# Altium project PIC_with_USB_2_0.PrjPcb
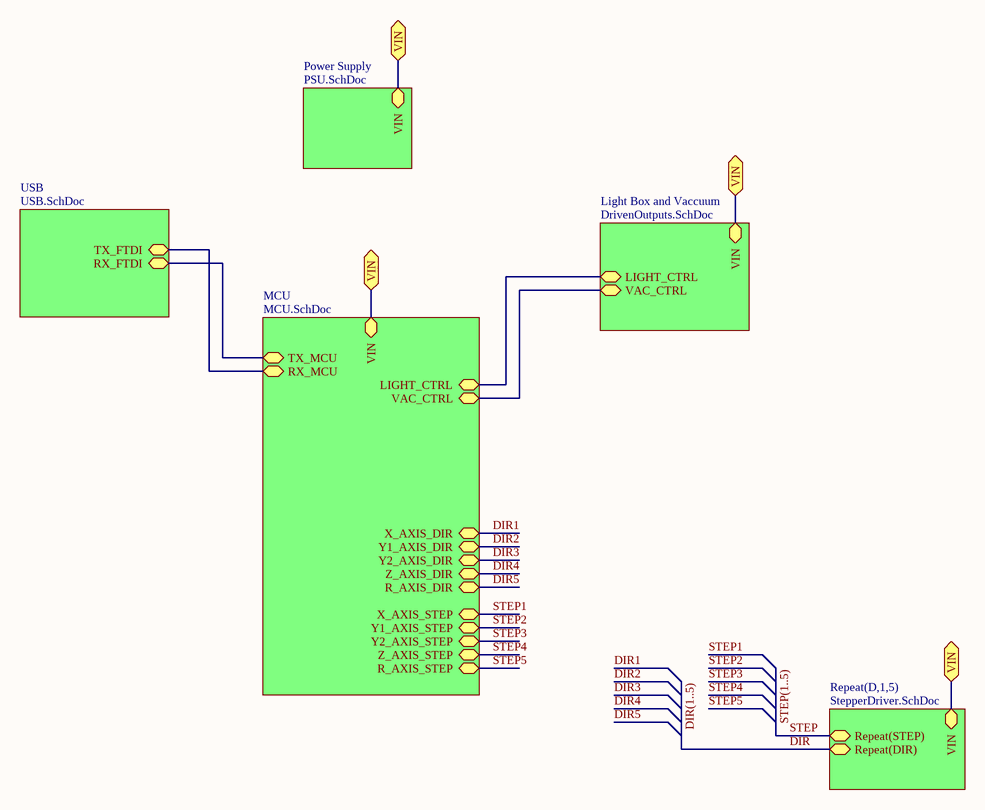
[diagram p0: Top.SchDoc]
6 sheets, 71 parts. Net scope: hierarchical (ports join the sheet entries above them; power ports are global).
Board file: picwithusb_REV_2_0.PcbDoc
Sheets:
  Top.SchDoc
    MCU = MCU.SchDoc
    USB = USB.SchDoc
    Light Box and Vaccuum = DrivenOutputs.SchDoc
    D1 = StepperDriver.SchDoc
    D2 = StepperDriver.SchDoc
    D3 = StepperDriver.SchDoc
    D4 = StepperDriver.SchDoc
    D5 = StepperDriver.SchDoc
    Power Supply = PSU.SchDoc

## Sheet Top.SchDoc
size A

### Sub-sheets
Light Box and Vaccuum = DrivenOutputs.SchDoc: LIGHT_CTRL, VAC_CTRL, VIN
MCU = MCU.SchDoc: VAC_CTRL, TX_MCU, RX_MCU, X_AXIS_STEP, Y2_AXIS_STEP, X_AXIS_DIR, Y2_AXIS_DIR, Z_AXIS_DIR, Y1_AXIS_DIR, Y1_AXIS_STEP, LIGHT_CTRL, VIN, R_AXIS_DIR, Z_AXIS_STEP, R_AXIS_STEP
Power Supply = PSU.SchDoc: VIN
Repeat(D,1,5) = StepperDriver.SchDoc: Repeat(STEP), Repeat(DIR), VIN
USB = USB.SchDoc: TX_FTDI, RX_FTDI

### Ports
VIN

### Nets
DIR: sheet Repeat(D,1,5)/Repeat(DIR)
RC6: sheet MCU/TX_MCU, sheet USB/RX_FTDI
RC7: sheet MCU/RX_MCU, sheet USB/TX_FTDI
RD2: sheet MCU/VAC_CTRL, sheet Light Box and Vaccuum/VAC_CTRL
RD3: sheet MCU/LIGHT_CTRL, sheet Light Box and Vaccuum/LIGHT_CTRL
STEP: sheet Repeat(D,1,5)/Repeat(STEP)
VIN: port VIN, sheet MCU/VIN, sheet Light Box and Vaccuum/VIN, sheet Repeat(D,1,5)/VIN, sheet Power Supply/VIN

### Buses and harness runs
bus DIR(1..5)
bus STEP(1..5)

## Sheet MCU.SchDoc
size A
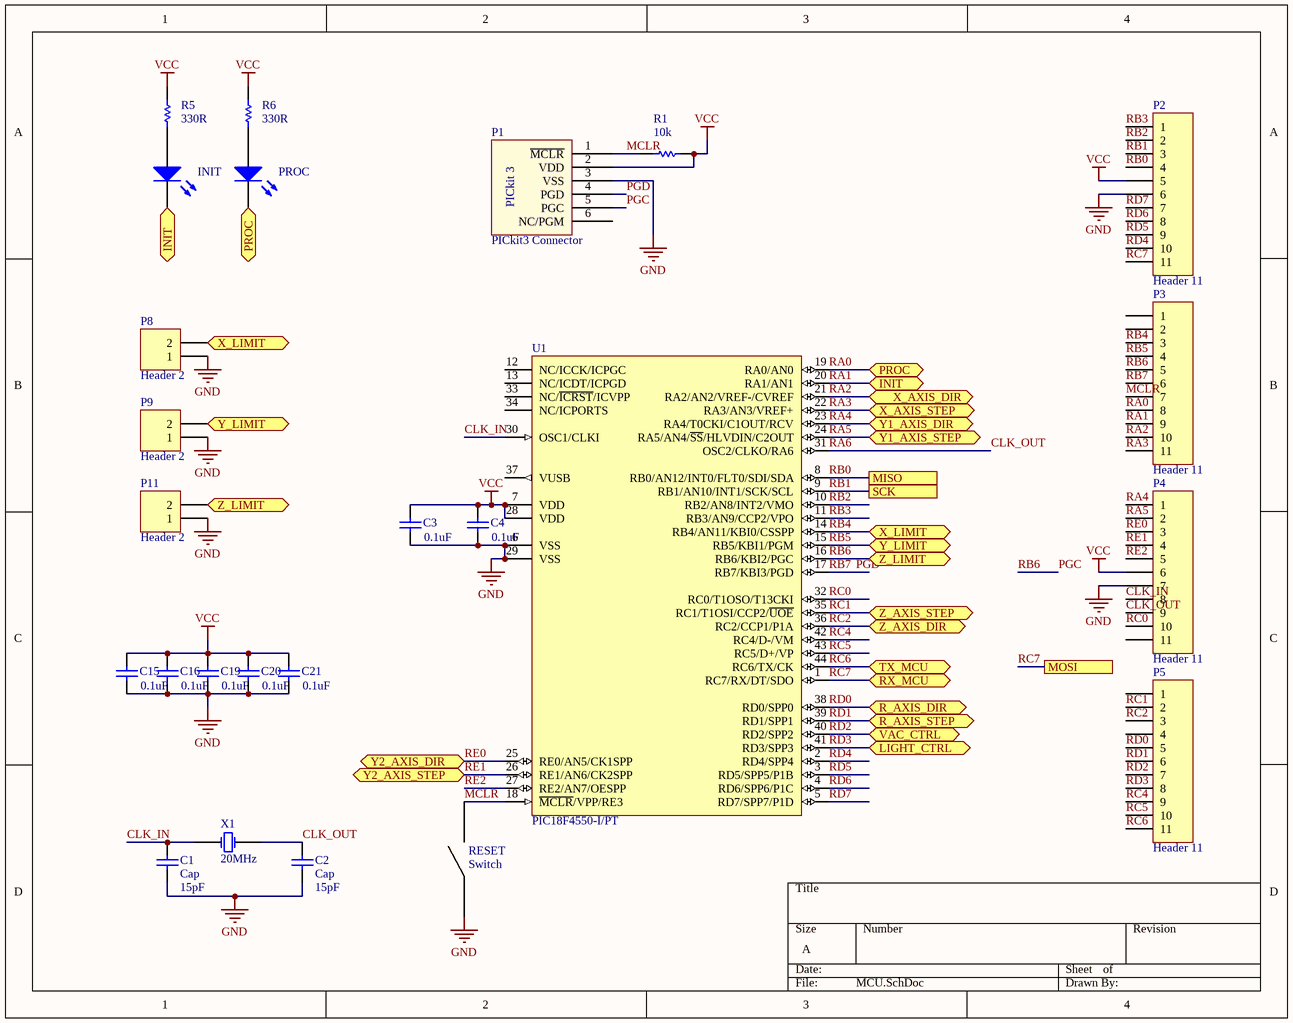
[diagram p1: MCU.SchDoc]

### Parts
C1  Cap  value 15pF  [0603]
C2  Cap  value 15pF  [0603]
C3  value 0.1uF  [0805]  (hidden comment: Cap)
C4  value 0.1uF  [0805]  (hidden comment: Cap)
C15  value 0.1uF  [0805]  (hidden comment: Cap)
C16  value 0.1uF  [0805]  (hidden comment: Cap)
C19  value 0.1uF  [0805]  (hidden comment: Cap)
C20  value 0.1uF  [0805]  (hidden comment: Cap)
C21  value 0.1uF  [0805]  (hidden comment: Cap)
INIT  LED1  [0805]  (value not drawn)
P1  PICkit3 Connector  [Right Angle PICkit Connector]
P2  Header 11  [HDR1X11]
P3  Header 11  [HDR1X11]
P4  Header 11  [HDR1X11]
P5  Header 11  [HDR1X11]
P8  Header 2  [HDR1X2]
P9  Header 2  [HDR1X2]
P11  Header 2  [HDR1X2]
PROC  LED2  [0805]  (value not drawn)
R1  value 10k  [0805]  (hidden comment: Res1)
R5  value 330R  [6-0805_N]  (hidden comment: Res1)
R6  value 330R  [6-0805_N]  (hidden comment: Res1)
RESET  Switch  [TACT_SWITCH]
U1  PIC18F4550-I/PT  [TQFP-PT44_N]
X1  Frequency: 20MHz  [HC49-US]  (hidden comment: Crystal)

### Ports
INIT, LIGHT_CTRL, MISO, MOSI, PROC, R_AXIS_DIR, R_AXIS_STEP, RX_MCU, SCK, TX_MCU, VAC_CTRL, X_AXIS_DIR, X_AXIS_STEP, X_LIMIT, Y1_AXIS_DIR, Y1_AXIS_STEP, Y2_AXIS_DIR, Y2_AXIS_STEP, Y_LIMIT, Z_AXIS_DIR, Z_AXIS_STEP, Z_LIMIT

### Nets
1: RESET.2
4: RESET.4
GND: C1.1 C2.1 C3.1 C4.1 C15.1 C16.1 C19.1 C20.1 C21.1 P1.3(VSS) P2.6 P4.7 P8.1 P9.1 P11.1 RESET.1 U1.6(VSS) U1.29(VSS)
VCC: C3.2 C4.2 C15.2 C16.2 C19.2 C20.2 C21.2 P1.2(VDD) P2.5 P4.6 R1.2 R5.2 R6.2 U1.7(VDD) U1.28(VDD)
CLK_IN: C1.2 P4.8 U1.30(OSC1/CLKI) X1.1(OSC1)
CLK_OUT: C2.2 P4.9 U1.31(OSC2/CLKO/RA6) X1.2(OSC2)  [also labelled RA6]
MCLR: P1.1(~{MCLR}) P3.7 R1.1 RESET.3 U1.18(~{MCLR}/VPP/RE3)
PGC: P1.5(PGC) P3.5 P11.2 U1.16(RB6/KBI2/PGC) ; port Z_LIMIT  [also labelled RB6]
PGD: P1.4(PGD) P3.6 U1.17(RB7/KBI3/PGD)  [also labelled RB7]
RA0: P3.8 PROC.2(K) U1.19(RA0/AN0) ; port PROC
RA1: INIT.2(K) P3.9 U1.20(RA1/AN1) ; port INIT
RA2: P3.10 U1.21(RA2/AN2/VREF-/CVREF) ; port X_AXIS_DIR  [project net DIR1]
RA3: P3.11 U1.22(RA3/AN3/VREF+) ; port X_AXIS_STEP
RA4: P4.1 U1.23(RA4/T0CKI/C1OUT/RCV) ; port Y1_AXIS_DIR  [project net DIR2]
RA5: P4.2 U1.24(RA5/AN4/~{SS}/HLVDIN/C2OUT) ; port Y1_AXIS_STEP
RB0: P2.4 U1.8(RB0/AN12/INT0/FLT0/SDI/SDA) ; port MISO
RB1: P2.3 U1.9(RB1/AN10/INT1/SCK/SCL) ; port SCK
RB2: P2.2 U1.10(RB2/AN8/INT2/VMO)
RB3: P2.1 U1.11(RB3/AN9/CCP2/VPO)
RB4: P3.3 P8.2 U1.14(RB4/AN11/KBI0/CSSPP) ; port X_LIMIT
RB5: P3.4 P9.2 U1.15(RB5/KBI1/PGM) ; port Y_LIMIT
RC0: P4.10 U1.32(RC0/T1OSO/T13CKI)
RC1: P5.2 U1.35(RC1/T1OSI/CCP2/~{UOE}) ; port Z_AXIS_STEP
RC2: P5.3 U1.36(RC2/CCP1/P1A) ; port Z_AXIS_DIR  [project net DIR4]
RC4: P5.9 U1.42(RC4/D-/VM)
RC5: P5.10 U1.43(RC5/D+/VP)
RC6: P5.11 U1.44(RC6/TX/CK) ; port TX_MCU
RC7: P2.11 U1.1(RC7/RX/DT/SDO) ; port MOSI, port RX_MCU
RD0: P5.5 U1.38(RD0/SPP0) ; port R_AXIS_DIR  [project net DIR5]
RD1: P5.6 U1.39(RD1/SPP1) ; port R_AXIS_STEP
RD2: P5.7 U1.40(RD2/SPP2) ; port VAC_CTRL
RD3: P5.8 U1.41(RD3/SPP3) ; port LIGHT_CTRL
RD4: P2.10 U1.2(RD4/SPP4)
RD5: P2.9 U1.3(RD5/SPP5/P1B)
RD6: P2.8 U1.4(RD6/SPP6/P1C)
RD7: P2.7 U1.5(RD7/SPP7/P1D)
RE0: P4.3 U1.25(RE0/AN5/CK1SPP) ; port Y2_AXIS_DIR  [project net DIR3]
RE1: P4.4 U1.26(RE1/AN6/CK2SPP) ; port Y2_AXIS_STEP
RE2: P4.5 U1.27(RE2/AN7/OESPP)
NetINIT_1: INIT.1(A) R5.1
NetPROC_1: PROC.1(A) R6.1

Not connected (* = marked no-connect by the designer): P1 6(NC/PGM); P3 1 2; P4 11; P5 1 4; U1 12(NC/ICCK/ICPGC) 13(NC/ICDT/ICPGD) 33(NC/~{ICRST}/ICVPP) 34(NC/ICPORTS) 37(VUSB)

### Notes on the sheet
- (in symbol PICkit 3 Connector) PICkit 3

### Library data of the parts
C1-C4 C15 C16 C19-C21 = Cap: Capacitor; Published: 8-Jun-2000; LatestRevisionDate: 17-Jul-2002; LatestRevisionNote: Re-released for DXP Platform.; PackageReference: RAD-0.3; Publisher: Altium Limited; PackageDescription: Radial Cap, Thru-Hole; 2 Leads; 0.3 in Pin Spacing
INIT PROC = LED0: Typical INFRARED GaAs LED; Published: 8-Jun-2000; LatestRevisionDate: 08-Jul-2005; LatestRevisionNote: Mech Layer 1 removed.; PackageReference: LED-0; Publisher: Altium Limited; PackageDescription: LED; 2 Leads
P1 = PICkit 3 Connector
P2-P5 = Header 11: Header, 11-Pin; LatestRevisionDate: 17-Jul-2002; LatestRevisionNote: Re-released for DXP Platform.; Publisher: Altium Limited
P8 P9 P11 = Header 2: Header, 2-Pin; LatestRevisionDate: 17-Jul-2002; LatestRevisionNote: Re-released for DXP Platform.; Publisher: Altium Limited
R1 R5 R6 = Res1: Resistor; Published: 8-Jun-2000; LatestRevisionDate: 17-Jul-2002; LatestRevisionNote: Re-released for DXP Platform.; PackageReference: AXIAL-0.3; Publisher: Altium Limited; PackageDescription: Axial Device, Thru-Hole; 2 Leads; 0.3 in Pin Spacing
RESET = Switch: Manufacturer Part No.: PTS645SM43SMTR92 LFS; Digi-Key Part No.: CKN9112CT-ND
U1 = PIC18F4550-I/PT: High Performance, Enhanced Flash, USB Microcontroller with nanoWatt Technology, 32K Flash, 44-Pin TQFP, Industrial Temperature Range; Published: 29-Jan-2009; LatestRevisionDate: 02-Dec-2009; LatestRevisionNote: Updated to datasheet revision E, Aug-2008; DatasheetVersion: revE, Aug-2008; PackageVersion: revBB, Aug-2009; PackageReference: TQFP-PT44; Publisher: Altium Limited; PackageDescription: 44-Lead Plastic Thin Quad Flatpack (PT) - 10x10x1mm Body, 2.00mm [TQFP]; Supplier 1: Digi-Key; Supplier Part Number 1: PIC18F4550-I/PT-ND; Supplier 2: Farnell; Supplier Part Number 2: 9321365; Supplier 3: Farnell; Supplier Part Number 3: 1528447; Code_JEDEC: MS-026; ComponentLink1Description: Datasheet; ComponentLink1URL: http://ww1.microchip.com/downloads/en/DeviceDoc/39632e.pdf; ComponentLink2Description: Packaging Specification; ComponentLink2URL: http://www.microchip.com/stellent/groups/techpub_sg/documents/packagingspec/en012702.pdf; ComponentLink3Description: Microchip.com Home; ComponentLink3URL: http://www.microchip.com/
X1 = Crystal 2-pin: 2-pin crystal resonator

## Sheet USB.SchDoc
size A
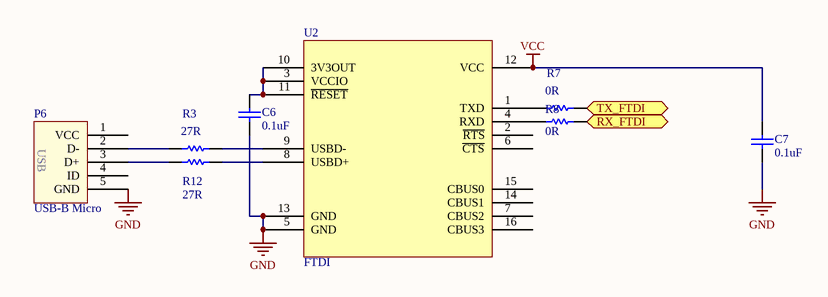
[diagram p2: USB.SchDoc]

### Parts
C6  value 0.1uF  [0805]  (hidden comment: Cap)
C7  value 0.1uF  [0805]  (hidden comment: Cap)
P6  USB-B Micro  [USB B Micro WM14338CT-ND]
R3  value 27R  [0805]  (hidden comment: Res1)
R7  value 0R  [0805]  (hidden comment: Res1)
R8  value 0R  [0805]  (hidden comment: Res1)
R12  value 27R  [0805]  (hidden comment: Res1)
U2  FTDI  [FTDI_SSOP_16]

### Ports
RX_FTDI, TX_FTDI

### Nets
GND: C6.1 C7.1 P6.5(GND) U2.5(GND) U2.13(GND)
VCC: C7.2 U2.12(VCC)
RC6: R8.1 ; port RX_FTDI
RC7: R7.2 ; port TX_FTDI
NetC6_2: C6.2 U2.3(VCCIO) U2.10(3V3OUT) U2.11(~{RESET})
NetP6_2: P6.2(D-) R3.1
NetP6_3: P6.3(D+) R12.1
NetR3_2: R3.2 U2.9(USBD-)
NetR7_1: R7.1 U2.1(TXD)
NetR8_2: R8.2 U2.4(RXD)
NetR12_2: R12.2 U2.8(USBD+)

Not connected (* = marked no-connect by the designer): P6 1(VCC) 4(ID); U2 2(~{RTS}) 6(~{CTS}) 7(CBUS2) 14(CBUS1) 15(CBUS0) 16(CBUS3)

### Notes on the sheet
- (in symbol USB-B Micro 4 Pad) USB

### Library data of the parts
C6 C7 = Capacitor: Chip Capacitor
P6 = USB-B Micro 4 Pad: USB-B SMT Connector; Manufacturer Part No.: 0476100001; Digi-Key Part No.: WM14338CT-ND
R3 R7 R8 R12 = Res1: Resistor; Published: 8-Jun-2000; LatestRevisionDate: 17-Jul-2002; LatestRevisionNote: Re-released for DXP Platform.; PackageReference: AXIAL-0.3; Publisher: Altium Limited; PackageDescription: Axial Device, Thru-Hole; 2 Leads; 0.3 in Pin Spacing
U2 = FTDI: USB-UART Converter; Manufacturer Part No.: FT230XS-U; Digi-Key Part No.: 768-1135-1-ND; ComponentLink1Description: Datasheet; ComponentLink1URL: http://www.ftdichip.com/Support/Documents/DataSheets/ICs/DS_FT230X.pdf

## Sheet DrivenOutputs.SchDoc
size A
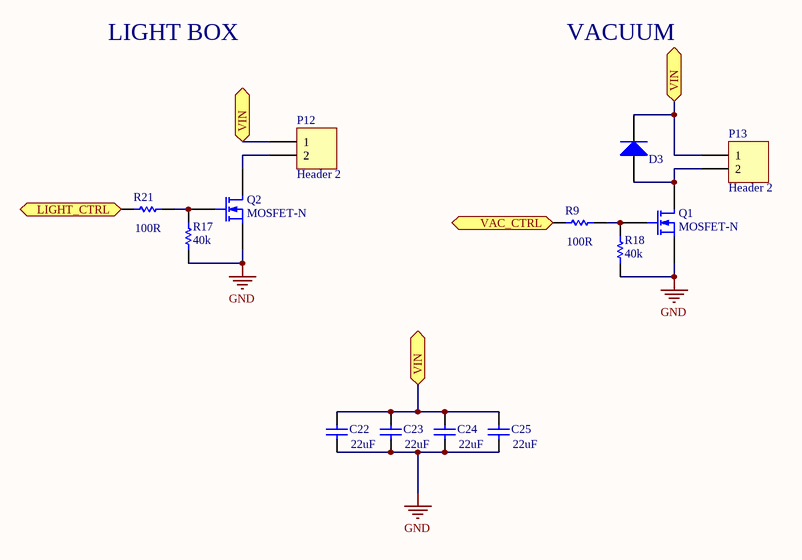
[diagram p3: DrivenOutputs.SchDoc]

### Parts
C22  value 22uF  [0805]  (hidden comment: Cap)
C23  value 22uF  [0805]  (hidden comment: Cap)
C24  value 22uF  [0805]  (hidden comment: Cap)
C25  value 22uF  [0805]  (hidden comment: Cap)
D3  Diode MMBD914  [SOT-23]  (value not drawn)
P12  Header 2  [HDR1X2]
P13  Header 2  [HDR1X2]
Q1  MOSFET-N  [DPAK]
Q2  MOSFET-N  [DPAK]
R9  value 100R  [0805]  (hidden comment: Res1)
R17  value 40k  [0805]  (hidden comment: Resistor)
R18  value 40k  [0805]  (hidden comment: Resistor)
R21  value 100R  [0805]  (hidden comment: Res1)

### Ports
LIGHT_CTRL, VAC_CTRL, VIN

### Nets
GND: C22.1 C23.1 C24.1 C25.1 Q1.3(S) Q2.3(S) R17.1 R18.1
RD2: R9.1 ; port VAC_CTRL
RD3: R21.1 ; port LIGHT_CTRL
VIN: C22.2 C23.2 C24.2 C25.2 D3.3(K) P12.1 P13.1 ; port VIN
NetD3_1: D3.1(A) P13.2 Q1.2(D)
NetP12_2: P12.2 Q2.2(D)
NetQ1_1: Q1.1(G) R9.2 R18.2
NetQ2_1: Q2.1(G) R17.2 R21.2

### Notes on the sheet
- LIGHT BOX
- VACUUM

### Library data of the parts
C22-C25 = Cap: Capacitor; Published: 8-Jun-2000; LatestRevisionDate: 17-Jul-2002; LatestRevisionNote: Re-released for DXP Platform.; PackageReference: RAD-0.3; Publisher: Altium Limited; PackageDescription: Radial Cap, Thru-Hole; 2 Leads; 0.3 in Pin Spacing
D3 = Diode MMBD914: Standard Diode; Manufacturer Part No.: MMBD914LT1G; Vf: 1V; Imax: 200mA; Vreverse: 100V; Digi-Key Part No.: MMBD914LT1GOSCT-ND
P12 P13 = Header 2: Header, 2-Pin; LatestRevisionDate: 17-Jul-2002; LatestRevisionNote: Re-released for DXP Platform.; Publisher: Altium Limited
Q1 Q2 = N-Channel MOSFET: Manufacturer Part No.: STD5NK40ZT4; Max. Vds: 400V; Max. Id: 3A; Digi-Key Part No.: 497-2477-1-ND
R9 R21 = Res1: Resistor; Published: 8-Jun-2000; LatestRevisionDate: 17-Jul-2002; LatestRevisionNote: Re-released for DXP Platform.; PackageReference: AXIAL-0.3; Publisher: Altium Limited; PackageDescription: Axial Device, Thru-Hole; 2 Leads; 0.3 in Pin Spacing
R17 R18 = Resistor: Chip Resistor

## Sheet StepperDriver.SchDoc
size A
Used 5 times, as channels D1, D2, D3, D4, D5. Parts and nets are listed once, with the designators drawn on the sheet.
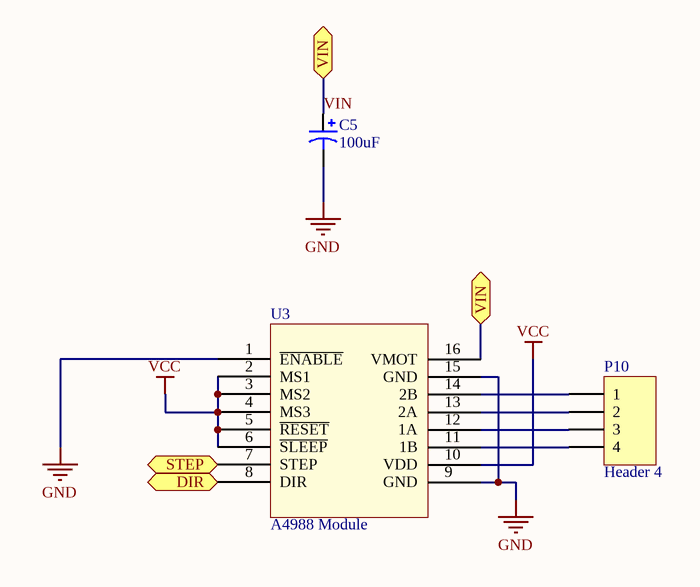
[diagram p4: StepperDriver.SchDoc]

### Parts
C5  value 100uF  [Aluminum Electrolytic Short]  (hidden comment: Cap)
P10  Header 4  [HDR1X4]
U3  A4988 Module  [A4988 Header]

### Ports
DIR, STEP, VIN

### Nets
GND: C5.2 U3.1(~{ENABLE}) U3.9(GND) U3.15(GND)
VCC: U3.2(MS1) U3.3(MS2) U3.4(MS3) U3.5(~{RESET}) U3.6(~{SLEEP}) U3.10(VDD)
DIR: U3.8(DIR) ; port DIR
STEP: U3.7(STEP) ; port STEP
VIN: C5.1 U3.16(VMOT) ; port VIN
NetP10_1: P10.1 U3.14(2B)
NetP10_2: P10.2 U3.13(2A)
NetP10_3: P10.3 U3.12(1A)
NetP10_4: P10.4 U3.11(1B)

### Channels
D1: designators end in A; ports DIR=DIR1 STEP=RA3 VIN=VIN
D2: designators end in B; ports DIR=DIR2 STEP=RA5 VIN=VIN
D3: designators end in C; ports DIR=DIR3 STEP=RE1 VIN=VIN
D4: designators end in D; ports DIR=DIR4 STEP=RC1 VIN=VIN
D5: designators end in E; ports DIR=DIR5 STEP=RD1 VIN=VIN

### Library data of the parts
C5 = Electrolytic Cap: Manufacturer Part No.: UWT1V101MCL1GS; Vmax: 35V; Digi-Key Part No.: 493-2203-1-ND
P10 = Header 4: Header, 4-Pin; LatestRevisionDate: 17-Jul-2002; LatestRevisionNote: Re-released for DXP Platform.; Publisher: Altium Limited
U3 = A4988 Module: Reference: https://www.pololu.com/product/1182

## Sheet PSU.SchDoc
size A
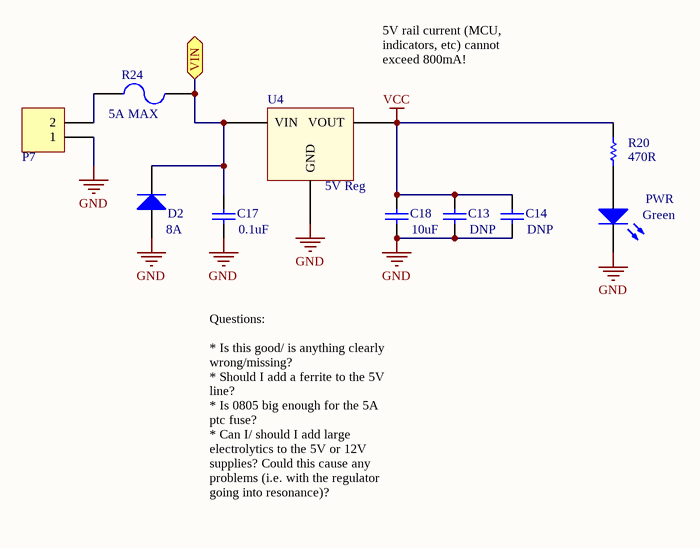
[diagram p5: PSU.SchDoc]

### Parts
C13  value DNP  [0805]  (hidden comment: Cap)
C14  value DNP  [0805]  (hidden comment: Cap)
C17  value 0.1uF  [0805]  (hidden comment: Cap)
C18  value 10uF  [0805]  (hidden comment: Cap)
D2  Max Current: 8A  [S8MC Diode]  (hidden comment: Diode S8MC)
P7  Screw Terminal  [Screw Terminal]  (value not drawn)
PWR  Color: Green  [0805]  (hidden comment: LED0)
R20  value 470R  [6-0805_N]  (hidden comment: Res1)
R24  Itrip: 5A MAX  [0805]  (hidden comment: Chip PTC)
U4  5V Reg  [4-Pin SOT223]

### Ports
VIN

### Nets
GND: C13.1 C14.1 C17.1 C18.1 D2.1(A) P7.1 PWR.2(K) U4.1(GND)
VCC: C13.2 C14.2 C18.2 R20.2 U4.2(VOUT)
VIN: C17.2 D2.2(C) R24.2 U4.3(VIN) ; port VIN
NetP7_2: P7.2 R24.1
NetPWR_1: PWR.1(A) R20.1

### Notes on the sheet
- (near U4) 5V rail current (MCU, indicators, etc) cannot exceed 800mA!
- Questions:
  * Is this good/ is anything clearly wrong/missing?
  * Should I add a ferrite to the 5V line?
  * Is 0805 big enough for the 5A ptc fuse?
  * Can I/ should I add large electrolytics to the 5V or 12V supplies? Could this cause any
  problems (i.e. with the regulator going into resonance)?

### Library data of the parts
C13 C14 C17 C18 = Cap: Capacitor; Published: 8-Jun-2000; LatestRevisionDate: 17-Jul-2002; LatestRevisionNote: Re-released for DXP Platform.; PackageReference: RAD-0.3; Publisher: Altium Limited; PackageDescription: Radial Cap, Thru-Hole; 2 Leads; 0.3 in Pin Spacing
D2 = Diode S8MC: Standard Diode; Manufacturer Part No.: S8MC-13; Max Voltage: 1kV; Digi-Key Part No.: S8MCDICT-ND
P7 = Screw Terminal: Manufacturer Part No.: 1935161; Digi-Key Part No.: 277-1667-ND
PWR = LED0: Typical INFRARED GaAs LED; Published: 8-Jun-2000; LatestRevisionDate: 08-Jul-2005; LatestRevisionNote: Mech Layer 1 removed.; PackageReference: LED-0; Publisher: Altium Limited; PackageDescription: LED; 2 Leads
R20 = Res1: Resistor; Published: 8-Jun-2000; LatestRevisionDate: 17-Jul-2002; LatestRevisionNote: Re-released for DXP Platform.; PackageReference: AXIAL-0.3; Publisher: Altium Limited; PackageDescription: Axial Device, Thru-Hole; 2 Leads; 0.3 in Pin Spacing
R24 = PTC
U4 = 5V Linear Regulator: Manufacturer Part No.: LD1117S50CTR; Output Current: 800mA; Digi-Key Part No.: 497-1243-1-ND

## Nets that join several sheets
GND: MCU (18 pins), USB (5 pins), DrivenOutputs (8 pins), D1 (C5A.2 U3A.1 U3A.9 U3A.15), D2 (C5B.2 U3B.1 U3B.9 U3B.15), D3 (C5C.2 U3C.1 U3C.9 U3C.15), D4 (C5D.2 U3D.1 U3D.9 U3D.15), D5 (C5E.2 U3E.1 U3E.9 U3E.15), PSU (8 pins)
VCC: MCU (15 pins), USB (C7.2 U2.12), D1 (6 pins), D2 (6 pins), D3 (6 pins), D4 (6 pins), D5 (6 pins), PSU (5 pins)
DIR1: MCU (P3.10 U1.21), D1 (U3A.8)
DIR2: MCU (P4.1 U1.23), D2 (U3B.8)
DIR3: MCU (P4.3 U1.25), D3 (U3C.8)
DIR4: MCU (P5.3 U1.36), D4 (U3D.8)
DIR5: MCU (P5.5 U1.38), D5 (U3E.8)
RA3: MCU (P3.11 U1.22), D1 (U3A.7)
RA5: MCU (P4.2 U1.24), D2 (U3B.7)
RC1: MCU (P5.2 U1.35), D4 (U3D.7)
RC6: MCU (P5.11 U1.44), USB (R8.1)
RC7: MCU (P2.11 U1.1), USB (R7.2)
RD1: MCU (P5.6 U1.39), D5 (U3E.7)
RD2: MCU (P5.7 U1.40), DrivenOutputs (R9.1)
RD3: MCU (P5.8 U1.41), DrivenOutputs (R21.1)
RE1: MCU (P4.4 U1.26), D3 (U3C.7)
VIN: DrivenOutputs (7 pins), D1 (C5A.1 U3A.16), D2 (C5B.1 U3B.16), D3 (C5C.1 U3C.16), D4 (C5D.1 U3D.16), D5 (C5E.1 U3E.16), PSU (C17.2 D2.2 R24.2 U4.3)